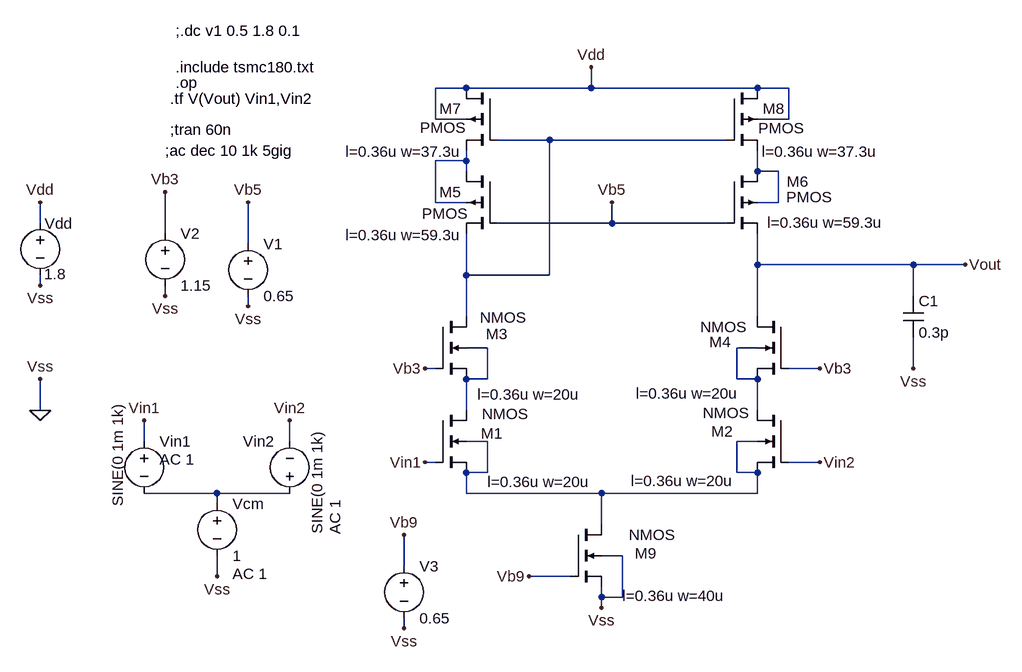
[diagram p0: schematic folded cascode op-amp-2.asc]
folded cascode op-amp-2.asc, the LTspice schematic file:
Version 4
SHEET 1 1336 680
WIRE 496 -560 448 -560
WIRE 688 -560 688 -592
WIRE 688 -560 496 -560
WIRE 944 -560 688 -560
WIRE 992 -560 944 -560
WIRE 496 -544 496 -560
WIRE 448 -512 448 -560
WIRE 496 -512 448 -512
WIRE 992 -512 992 -560
WIRE 992 -512 944 -512
WIRE 624 -480 544 -480
WIRE 896 -480 624 -480
WIRE 496 -448 496 -464
WIRE 496 -448 448 -448
WIRE 496 -432 496 -448
WIRE 944 -432 944 -464
WIRE 976 -432 944 -432
WIRE 448 -384 448 -448
WIRE 496 -384 448 -384
WIRE 976 -384 976 -432
WIRE 976 -384 944 -384
WIRE -160 -352 -160 -384
WIRE 720 -352 720 -384
WIRE 720 -352 544 -352
WIRE 896 -352 720 -352
WIRE 32 -336 32 -400
WIRE 160 -320 160 -384
WIRE 944 -288 944 -336
WIRE 1184 -288 944 -288
WIRE 1264 -288 1184 -288
WIRE 496 -272 496 -336
WIRE 624 -272 624 -480
WIRE 624 -272 496 -272
WIRE -160 -256 -160 -272
WIRE 32 -240 32 -256
WIRE 1184 -240 1184 -288
WIRE 160 -224 160 -240
WIRE 496 -208 496 -272
WIRE 944 -208 944 -288
WIRE 528 -160 496 -160
WIRE 944 -160 912 -160
WIRE 448 -128 432 -128
WIRE 1040 -128 992 -128
WIRE 1184 -128 1184 -176
WIRE 528 -112 528 -160
WIRE 528 -112 496 -112
WIRE 912 -112 912 -160
WIRE 944 -112 912 -112
WIRE -160 -64 -160 -112
WIRE 496 -64 496 -112
WIRE 944 -64 944 -112
WIRE 0 -16 0 -48
WIRE 224 -16 224 -48
WIRE 528 -16 496 -16
WIRE 944 -16 912 -16
WIRE 448 16 432 16
WIRE 1040 16 992 16
WIRE 528 32 528 -16
WIRE 528 32 496 32
WIRE 912 32 912 -16
WIRE 944 32 912 32
WIRE 112 64 0 64
WIRE 224 64 112 64
WIRE 496 64 496 32
WIRE 704 64 496 64
WIRE 944 64 944 32
WIRE 944 64 704 64
WIRE 112 80 112 64
WIRE 704 112 704 64
WIRE 736 160 704 160
WIRE 400 176 400 128
WIRE 112 192 112 160
WIRE 656 192 592 192
WIRE 704 224 704 208
WIRE 736 224 736 160
WIRE 736 224 704 224
WIRE 704 240 704 224
WIRE 400 272 400 256
FLAG -160 -64 0
FLAG -160 -112 Vss
FLAG -160 -256 Vss
FLAG -160 -384 Vdd
FLAG 432 16 Vin1
FLAG 432 -128 Vb3
FLAG 160 -224 Vss
FLAG 160 -384 Vb5
FLAG 32 -240 Vss
FLAG 32 -400 Vb3
FLAG 704 240 Vss
FLAG 1040 -128 Vb3
FLAG 1040 16 Vin2
FLAG 688 -592 Vdd
FLAG 720 -384 Vb5
FLAG 1264 -288 Vout
FLAG 112 192 Vss
FLAG 0 -48 Vin1
FLAG 224 -48 Vin2
FLAG 1184 -128 Vss
FLAG 592 192 Vb9
FLAG 400 128 Vb9
FLAG 400 272 Vss
SYMBOL nmos4 448 -64 R0
WINDOW 0 70 36 Left 2
WINDOW 3 72 6 Left 2
WINDOW 123 239 110 Right 2
SYMATTR InstName M1
SYMATTR Value2 l=0.36u w=20u
SYMBOL voltage -160 -368 R0
WINDOW 123 0 0 Left 0
WINDOW 39 0 0 Left 0
WINDOW 0 7 17 Left 2
WINDOW 3 6 94 Left 2
SYMATTR InstName Vdd
SYMATTR Value 1.8
SYMBOL nmos4 448 -208 R0
WINDOW 0 78 27 Left 2
WINDOW 3 69 1 Left 2
WINDOW 123 224 120 Right 2
SYMATTR InstName M3
SYMATTR Value2 l=0.36u w=20u
SYMBOL voltage 160 -336 R0
WINDOW 123 0 0 Left 0
WINDOW 39 0 0 Left 0
SYMATTR InstName V1
SYMATTR Value 0.65
SYMBOL voltage 32 -352 R0
WINDOW 123 0 0 Left 0
WINDOW 39 0 0 Left 0
SYMATTR InstName V2
SYMATTR Value 1.15
SYMBOL nmos4 992 -64 M0
WINDOW 0 85 33 Left 2
WINDOW 3 60 4 Left 2
WINDOW 123 243 109 Right 2
SYMATTR InstName M2
SYMATTR Value2 l=0.36u w=20u
SYMBOL nmos4 992 -208 M0
WINDOW 0 88 39 Left 2
WINDOW 3 64 16 Left 2
WINDOW 123 235 118 Right 2
SYMATTR InstName M4
SYMATTR Value2 l=0.36u w=20u
SYMBOL pmos4 896 -432 R0
WINDOW 123 63 79 Left 2
WINDOW 0 93 16 Left 2
WINDOW 3 92 40 Left 2
SYMATTR Value2 l=0.36u w=59.3u
SYMATTR InstName M6
SYMBOL pmos4 896 -560 R0
WINDOW 123 55 98 Left 2
WINDOW 3 49 62 Left 2
SYMATTR Value2 l=0.36u w=37.3u
SYMATTR InstName M8
SYMBOL pmos4 544 -432 M0
WINDOW 123 55 98 Left 2
WINDOW 3 46 65 Left 2
SYMATTR Value2 l=0.36u w=59.3u
SYMATTR InstName M5
SYMBOL pmos4 544 -560 M0
WINDOW 123 55 98 Left 2
WINDOW 3 49 61 Left 2
SYMATTR Value2 l=0.36u w=37.3u
SYMATTR InstName M7
SYMBOL voltage 112 64 R0
WINDOW 123 24 124 Left 2
WINDOW 39 0 0 Left 0
SYMATTR InstName Vcm
SYMATTR Value 1
SYMATTR Value2 AC 1
SYMBOL voltage 0 -32 R0
WINDOW 3 -41 -42 VRight 2
WINDOW 123 24 44 Left 2
WINDOW 39 0 0 Left 0
SYMATTR InstName Vin1
SYMATTR Value SINE(0 1m 1k)
SYMATTR Value2 AC 1
SYMBOL voltage 224 80 R180
WINDOW 0 24 96 Left 2
WINDOW 3 -42 -47 VRight 2
WINDOW 123 -70 -47 VRight 2
WINDOW 39 0 0 Left 0
SYMATTR InstName Vin2
SYMATTR Value SINE(0 1m 1k)
SYMATTR Value2 AC 1
SYMBOL cap 1168 -240 R0
SYMATTR InstName C1
SYMATTR Value 0.3p
SYMBOL nmos4 656 112 R0
WINDOW 0 99 44 Left 2
WINDOW 3 90 16 Left 2
WINDOW 123 239 110 Right 2
SYMATTR InstName M9
SYMATTR Value2 l=0.36u w=40u
SYMBOL voltage 400 160 R0
SYMATTR InstName V3
SYMATTR Value 0.65
TEXT 48 -592 Left 2 !.include tsmc180.txt
TEXT 48 -568 Left 2 !.op
TEXT 40 -544 Left 2 !.tf V(Vout) Vin1,Vin2
TEXT 32 -464 Left 2 !;ac dec 10 1k 5gig
TEXT 40 -496 Left 2 !;tran 60n
TEXT 48 -648 Left 2 !;.dc v1 0.5 1.8 0.1

The netlist it stands for:
* folded cascode op-amp-2.asc
M1 N004 Vin1 N006 N006 NMOS l=0.36u w=20u
Vdd Vdd 0 1.8
M3 N001 Vb3 N004 N004 NMOS l=0.36u w=20u
V1 Vb5 0 0.65
V2 Vb3 0 1.15
M2 N005 Vin2 N006 N006 NMOS l=0.36u w=20u
M4 Vout Vb3 N005 N005 NMOS l=0.36u w=20u
M6 N003 Vb5 Vout N003 PMOS l=0.36u w=59.3u
M8 Vdd N001 N003 Vdd PMOS l=0.36u w=37.3u
M5 N002 Vb5 N001 N002 PMOS l=0.36u w=59.3u
M7 Vdd N001 N002 Vdd PMOS l=0.36u w=37.3u
Vcm N007 0 1 AC 1
Vin1 Vin1 N007 SINE(0 1m 1k) AC 1
Vin2 N007 Vin2 SINE(0 1m 1k) AC 1
C1 Vout 0 0.3p
M9 N006 Vb9 0 0 NMOS l=0.36u w=40u
V3 Vb9 0 0.65
.model NMOS NMOS
.model PMOS PMOS
.lib standard.mos
.include tsmc180.txt
.op
.tf V(Vout) Vin1,Vin2
;ac dec 10 1k 5gig
;tran 60n
;.dc v1 0.5 1.8 0.1
.backanno
.end